# Altium schematic sheet Sheet1.SchDoc
size A
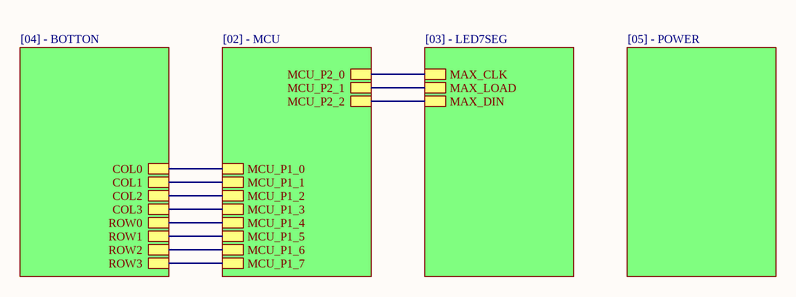
[diagram p0: Sheet1.SchDoc]

## Sub-sheets
Designator = [04] - BOTTON: ROW3, COL2, ROW0, ROW1, COL1, COL0, COL3, ROW2
? = [02] - MCU: MCU_P2_0, MCU_P2_1, MCU_P2_2, MCU_P1_0, MCU_P1_6, MCU_P1_7, MCU_P1_4, MCU_P1_5, MCU_P1_3, MCU_P1_2, MCU_P1_1
? = [05] - POWER: no entries
? = [03] - LED7SEG: MAX_CLK, MAX_DIN, MAX_LOAD

## Nets
(unnamed): sheet /MCU_P2_0, sheet /MAX_CLK
(unnamed): sheet /MCU_P2_1, sheet /MAX_LOAD
(unnamed): sheet /MCU_P2_2, sheet /MAX_DIN
(unnamed): sheet /MCU_P1_0, sheet Designator/COL0
(unnamed): sheet /MCU_P1_6, sheet Designator/ROW2
(unnamed): sheet /MCU_P1_7, sheet Designator/ROW3
(unnamed): sheet /MCU_P1_4, sheet Designator/ROW0
(unnamed): sheet /MCU_P1_5, sheet Designator/ROW1
(unnamed): sheet /MCU_P1_3, sheet Designator/COL3
(unnamed): sheet /MCU_P1_2, sheet Designator/COL2
(unnamed): sheet /MCU_P1_1, sheet Designator/COL1